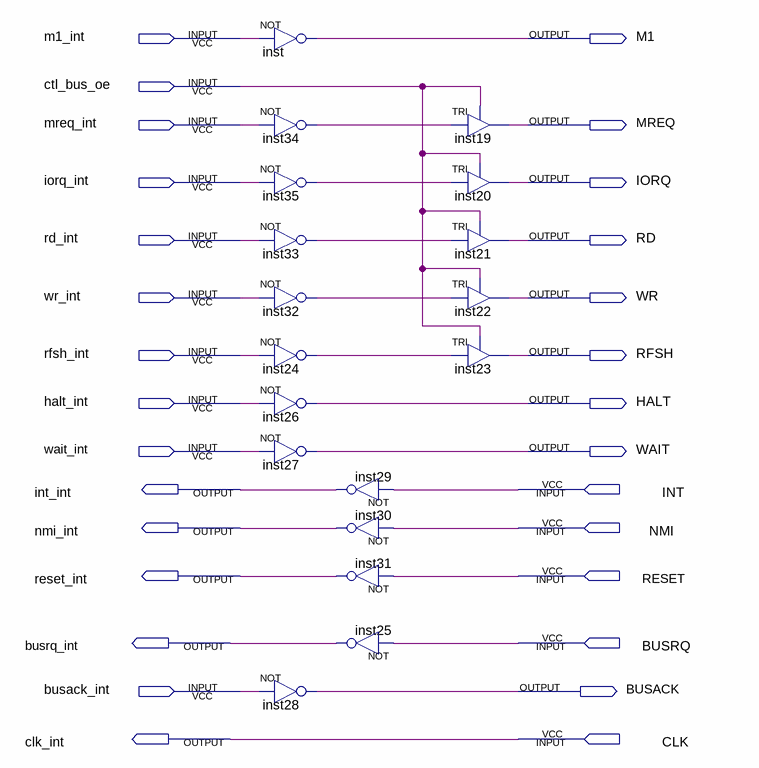
[diagram p0: schematic sheet]
// Quartus schematic control_pads.bdf as structural Verilog: 18 symbols, 29 pins
module control_pads (
  input  m1_int,
  input  ctl_bus_oe,
  input  mreq_int,
  input  iorq_int,
  input  rd_int,
  input  wr_int,
  input  rfsh_int,
  input  halt_int,
  input  wait_int,
  input  INT,
  input  NMI,
  input  RESET,
  input  BUSRQ,
  input  busack_int,
  input  CLK,
  output M1,
  output MREQ,
  output IORQ,
  output RD,
  output WR,
  output RFSH,
  output HALT,
  output WAIT,
  output int_int,
  output nmi_int,
  output reset_int,
  output busrq_int,
  output BUSACK,
  output clk_int
);

  wire inst24_out, inst32_out, inst33_out, inst34_out, inst35_out;

  not inst (M1, m1_int);
  not inst34 (inst34_out, mreq_int);
  not inst35 (inst35_out, iorq_int);
  not inst33 (inst33_out, rd_int);
  not inst32 (inst32_out, wr_int);
  not inst24 (inst24_out, rfsh_int);
  not inst26 (HALT, halt_int);
  not inst27 (WAIT, wait_int);
  not inst28 (BUSACK, busack_int);
  not inst29 (int_int, INT);
  not inst30 (nmi_int, NMI);
  not inst31 (reset_int, RESET);
  not inst25 (busrq_int, BUSRQ);
  TRI inst19 (.IN(inst34_out), .OE(ctl_bus_oe), .OUT(MREQ));
  TRI inst20 (.IN(inst35_out), .OE(ctl_bus_oe), .OUT(IORQ));
  TRI inst21 (.IN(inst33_out), .OE(ctl_bus_oe), .OUT(RD));
  TRI inst22 (.IN(inst32_out), .OE(ctl_bus_oe), .OUT(WR));
  TRI inst23 (.IN(inst24_out), .OE(ctl_bus_oe), .OUT(RFSH));

  assign clk_int = CLK;
endmodule
